# Altium schematic sheet projet_pcb_bluepill_f103.SchDoc
size A2
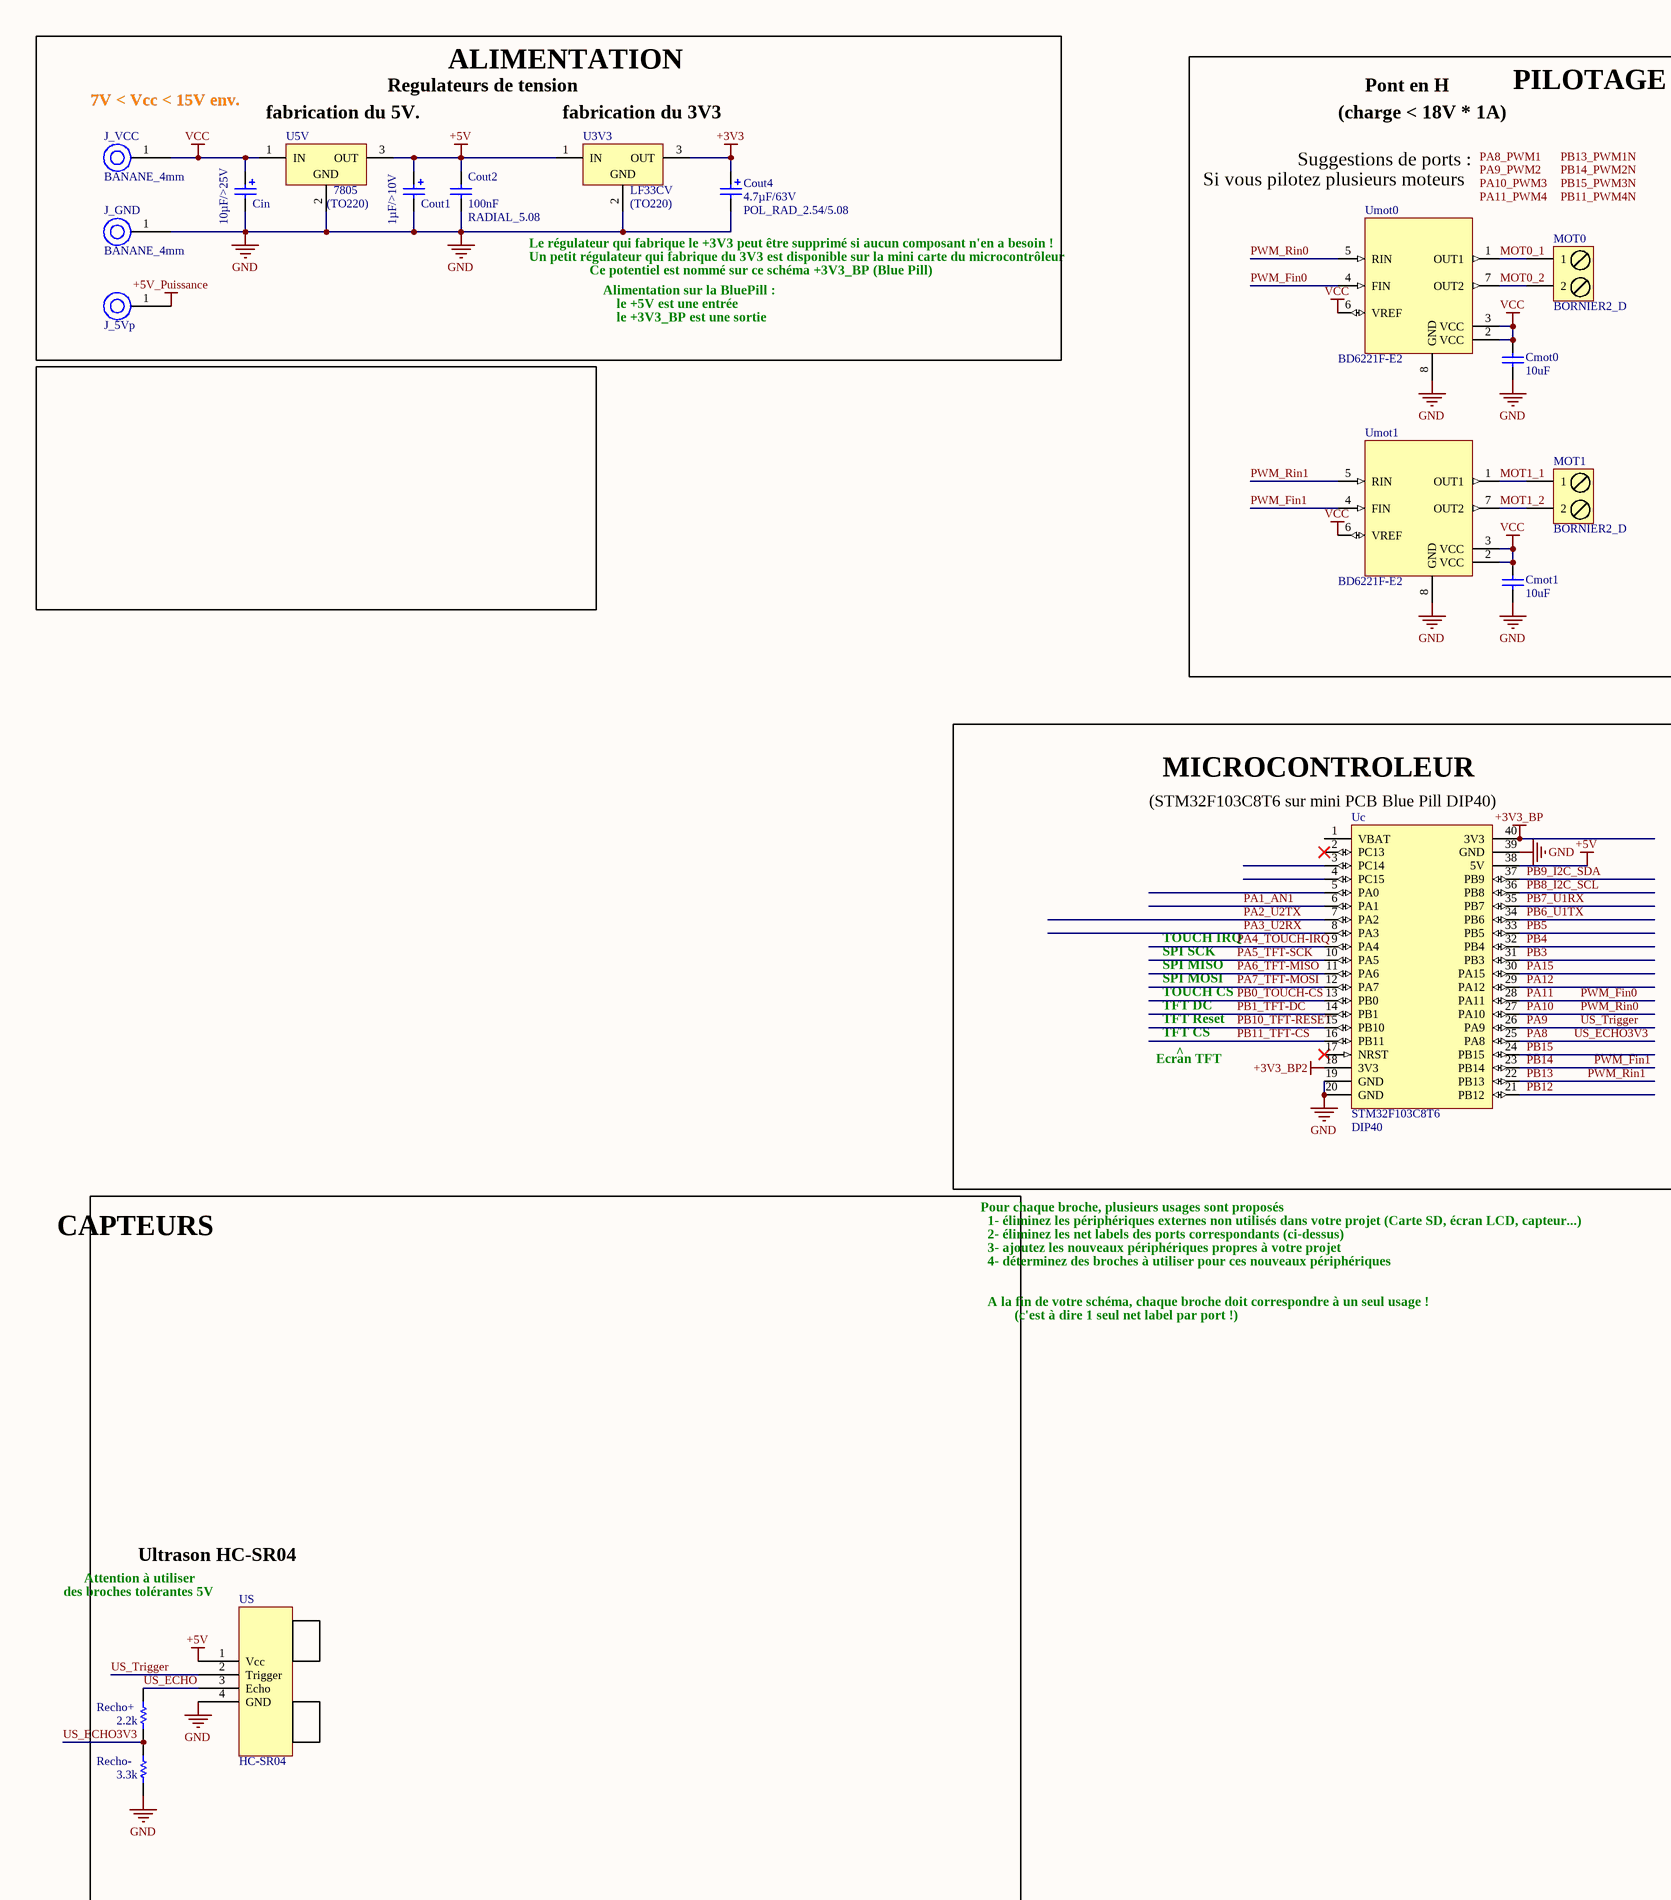
[diagram p0: projet_pcb_bluepill_f103.SchDoc, left]
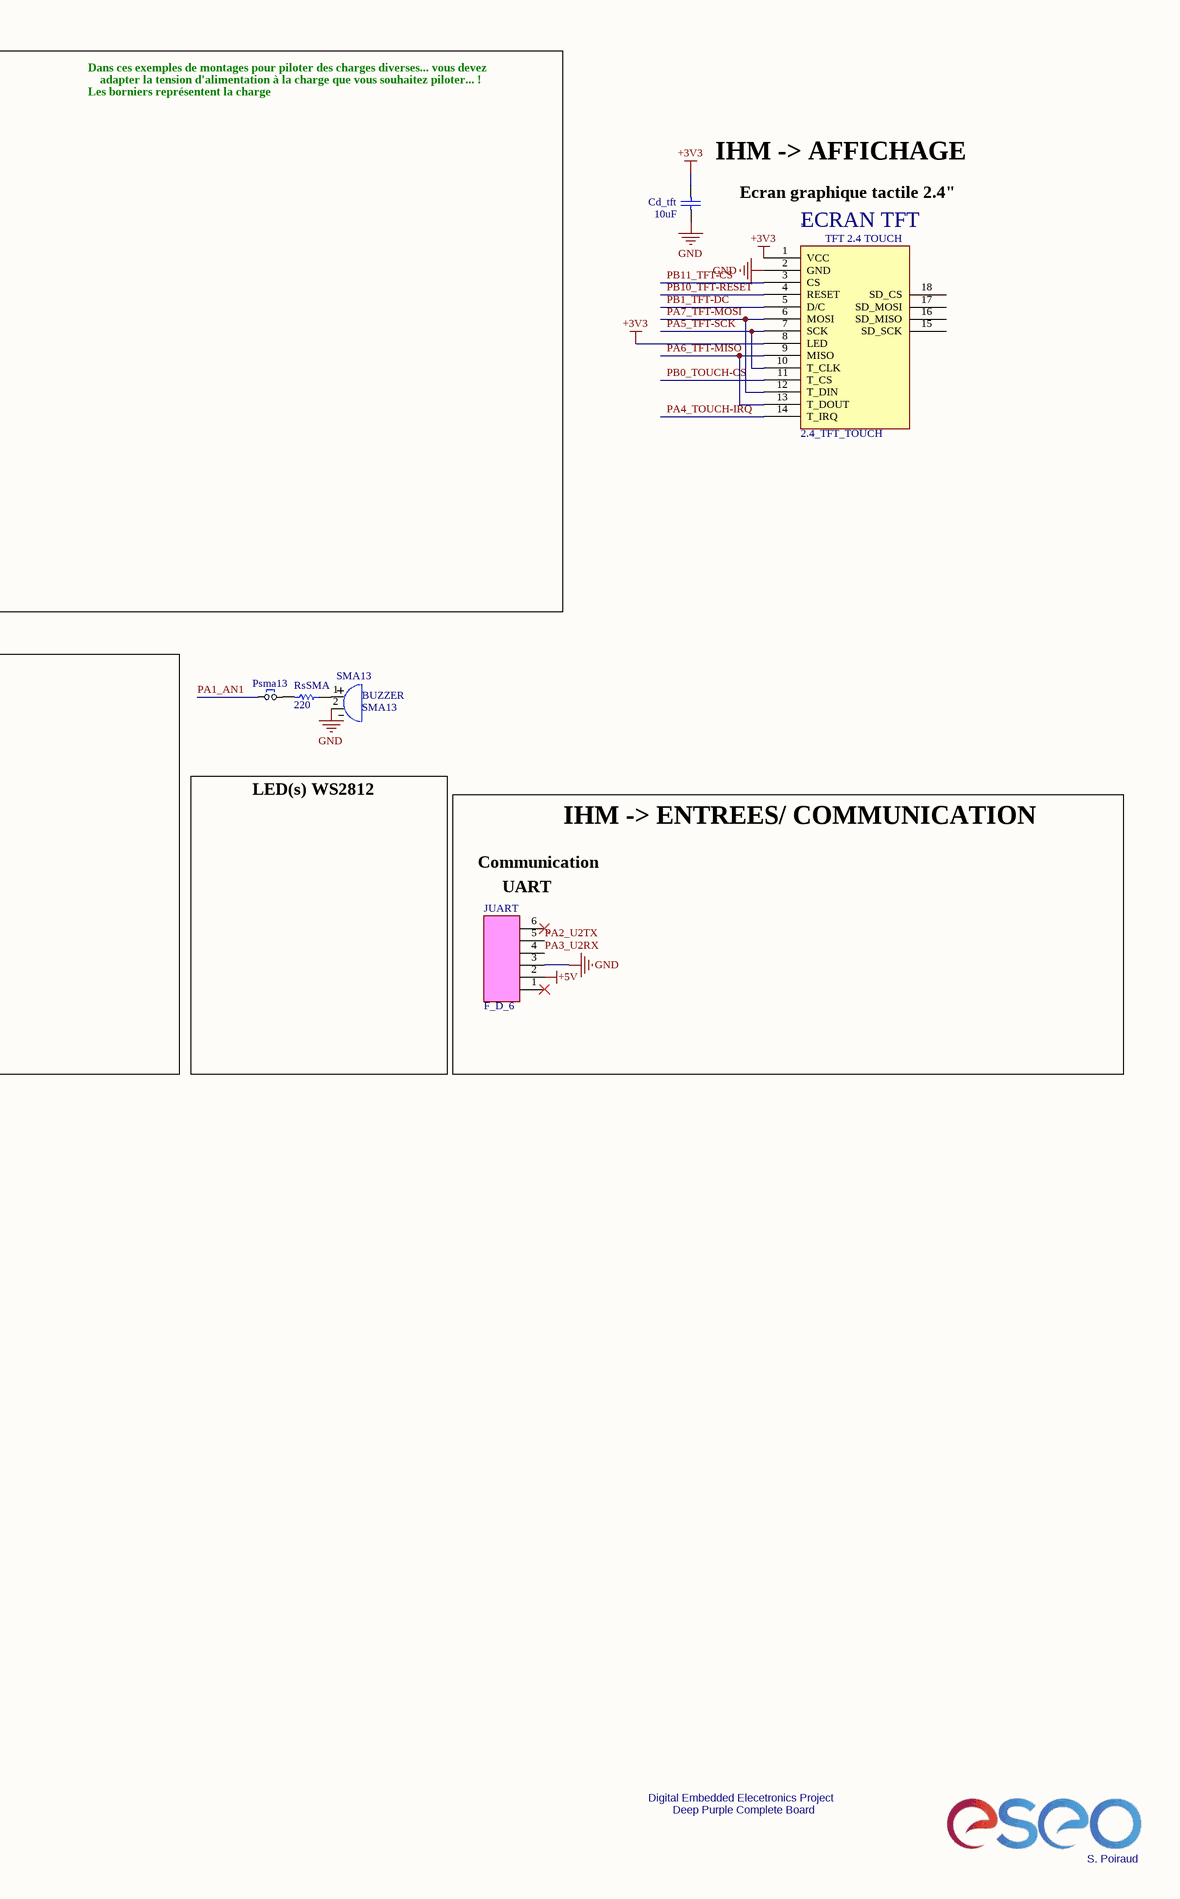
[diagram p1: projet_pcb_bluepill_f103.SchDoc, right]

## Parts
*  2.4_TFT_TOUCH  [2.4_TFT_TOUCH]
Cd_tft  10uF  [CONDENSATEUR_POLARISE_ELECTROLYTIQUE_RADIAL_2.54/5.08]
Cin  value 10µF/>25V  [CONDENSATEUR_POLARISE_ELECTROLYTIQUE_RADIAL_2.0/5.08]  (hidden comment: CONDENSATEUR_POL_ELECTROLY_RAD_2.0/5.08)
Cmot0  10uF  [CONDENSATEUR_POLARISE_ELECTROLYTIQUE_RADIAL_2.0/5.08]
Cmot1  10uF  [CONDENSATEUR_POLARISE_ELECTROLYTIQUE_RADIAL_2.0/5.08]
Cout1  value 1µF/>10V  [CONDENSATEUR_POLARISE_ELECTROLYTIQUE_RADIAL_2.0/5.08]  (hidden comment: CONDENSATEUR_POL_ELECTROLY_RAD_2.0/5.08)
Cout2  value 100nF  Type: RADIAL_5.08  [CONDENSATEUR_CERAMIQUE_RADIAL_5.08]  (hidden comment: CONDENSATEUR_CER_RAD_5.08)
Cout4  value 4.7µF/63V  Type: POL_RAD_2.54/5.08  [CONDENSATEUR_POLARISE_ELECTROLYTIQUE_RADIAL_2.54/5.08]  (hidden comment: CONDENSATEUR_POL_ELECTROLY_RAD_2.54/5.08)
J_5Vp  DOUILLE BANANE 4mm  [DOUILLE_BANANE_4mm]  (value not drawn)
J_GND  Type: BANANE_4mm  [DOUILLE_BANANE_4mm]  (hidden comment: DOUILLE BANANE 4mm)
J_VCC  Type: BANANE_4mm  [DOUILLE_BANANE_4mm]  (hidden comment: DOUILLE BANANE 4mm)
JUART  Type: F_D_6  [BARRETTE_6_F_D]  (hidden comment: BARRETTE_6 CONTACTS_1 RANGEE_FEMELLE_DROITE)
MOT0  Type: BORNIER2_D  [BORNIER2_A_VIS]  (hidden comment: BORNIER2 DROIT A VIS)
MOT1  Type: BORNIER2_D  [BORNIER2_A_VIS]  (hidden comment: BORNIER2 DROIT A VIS)
Psma13  Jumper SIP 2.54  [HDR1X2]  (value not drawn)
Recho+  2.2k  [R1206_N]
Recho-  3.3k  [R1206_N]
RsSMA  220  [R1206_N]
SMA13  value SMA13  Type: BUZZER  [BUZZER_SMA13]  (hidden comment: BUZZER_SMA13)
U3V3  Type: LF33CV  Package: (TO220)  [REGULATEUR_TO220_78XX]  (hidden comment: REGULATEUR_TO220_78XX)
U5V  Type: 7805  Package: (TO220)  [REGULATEUR_TO220_78XX]  (hidden comment: REGULATEUR_TO220_78XX)
Uc  Type: STM32F103C8T6  Package: DIP40  [STM32F103C8T6_DIP40]  (hidden comment: STM32F103C8T6/PCB_DIP40)
Umot0  BD6221F-E2  [SOIC8_PAS=1.27_LARG=4_LONG=5]
Umot1  BD6221F-E2  [SOIC8_PAS=1.27_LARG=4_LONG=5]
US  HC-SR04  [HC-SR04]

## Blocks framed on the sheet
ALIMENTATION: Cin Cout1 Cout2 Cout4 J_5Vp J_GND J_VCC U3V3 U5V
MICROCONTROLEUR: Uc
IHM -> ENTREES/ COMMUNICATION: JUART
Ultrason HC-SR04: Recho+ Recho- US

## Nets
+3V3: *.1(VCC) *.8(LED) Cd_tft.1 Cout4.1 U3V3.3(OUT)
+3V3_BP: Uc.40(3V3)
+3V3_BP2: Uc.18(3V3)
+5V: Cout1.1 Cout2.2 JUART.2 U3V3.1(IN) U5V.3(OUT) Uc.38(5V) US.1(Vcc)
+5V_Puissance: J_5Vp.1
GND: *.2(GND) Cd_tft.2 Cin.2 Cmot0.1 Cmot1.1 Cout1.2 Cout2.1 Cout4.2 J_GND.1 JUART.3 Recho-.1 SMA13.2 U3V3.2(GND) U5V.2(GND) Uc.19(GND) Uc.20(GND) Uc.39(GND) Umot0.8(GND) Umot1.8(GND) US.4(GND)
VCC: Cin.1 Cmot0.2 Cmot1.2 J_VCC.1 U5V.1(IN) Umot0.2(VCC) Umot0.3(VCC) Umot0.6(VREF) Umot1.2(VCC) Umot1.3(VCC) Umot1.6(VREF)
MOT0_1: MOT0.1 Umot0.1(OUT1)
MOT0_2: MOT0.2 Umot0.7(OUT2)
MOT1_1: MOT1.1 Umot1.1(OUT1)
MOT1_2: MOT1.2 Umot1.7(OUT2)
PA1_AN1: Psma13.1 Uc.6(PA1)
PA2_U2TX: JUART.5 Uc.7(PA2)
PA3_U2RX: JUART.4 Uc.8(PA3)
PA4_TOUCH-IRQ: *.14(T_IRQ) Uc.9(PA4)
PA5_TFT-SCK: *.7(SCK) *.10(T_CLK) Uc.10(PA5)
PA6_TFT-MISO: *.9(MISO) *.13(T_DOUT) Uc.11(PA6)
PA7_TFT-MOSI: *.6(MOSI) *.12(T_DIN) Uc.12(PA7)
PA8: Recho+.1 Recho-.2 Uc.25(PA8)  [also labelled US_ECHO3V3]
PA9: Uc.26(PA9) US.2(Trigger)  [also labelled US_Trigger]
PA10: Uc.27(PA10) Umot0.5(RIN)  [also labelled PWM_Rin0]
PA11: Uc.28(PA11) Umot0.4(FIN)  [also labelled PWM_Fin0]
PA12: Uc.29(PA12)
PA15: Uc.30(PA15)
PB0_TOUCH-CS: *.11(T_CS) Uc.13(PB0)
PB1_TFT-DC: *.5(D/C) Uc.14(PB1)
PB3: Uc.31(PB3)
PB4: Uc.32(PB4)
PB5: Uc.33(PB5)
PB6_U1TX: Uc.34(PB6)
PB7_U1RX: Uc.35(PB7)
PB8_I2C_SCL: Uc.36(PB8)
PB9_I2C_SDA: Uc.37(PB9)
PB10_TFT-RESET: *.4(RESET) Uc.15(PB10)
PB11_TFT-CS: *.3(CS) Uc.16(PB11)
PB12: Uc.21(PB12)
PB13: Uc.22(PB13) Umot1.5(RIN)  [also labelled PWM_Rin1]
PB14: Uc.23(PB14) Umot1.4(FIN)  [also labelled PWM_Fin1]
PB15: Uc.24(PB15)
US_ECHO: Recho+.2 US.3(Echo)
NetPsma13_2: Psma13.2 RsSMA.2
NetRsSMA_1: RsSMA.1 SMA13.1

Not connected (* = marked no-connect by the designer): * 15(SD_SCK) 16(SD_MISO) 17(SD_MOSI) 18(SD_CS); JUART 1* 6*; Uc 1(VBAT) 2(PC13)* 3(PC14) 4(PC15) 5(PA0) 17(NRST)*

## Notes on the sheet
- 7V < Vcc < 15V env.
- Regulateurs de tension
- Pont en H
- PILOTAGE
- Dans ces exemples de montages pour piloter des charges diverses... vous devez
- Les borniers représentent la charge
- adapter la tension d'alimentation à la charge que vous souhaitez piloter... !
- (near U5V) fabrication du 5V.
- (near U3V3) fabrication du 3V3
- Suggestions de ports :
- (charge < 18V * 1A)
- Le régulateur qui fabrique le +3V3 peut être supprimé si aucun composant n'en a besoin !
- Si vous pilotez plusieurs moteurs
- (near Cd_tft) IHM -> AFFICHAGE
- Ecran graphique tactile 2.4"
- Un petit régulateur qui fabrique du 3V3 est disponible sur la mini carte du microcontrôleur
- Ce potentiel est nommé sur ce schéma +3V3_BP (Blue Pill)
- Alimentation sur la BluePill :
- le +5V est une entrée
- (near *) ECRAN TFT
- le +3V3_BP est une sortie
- (near Uc) (STM32F103C8T6 sur mini PCB Blue Pill DIP40)
- LED(s) WS2812
- SPI SCK
- SPI MISO
- SPI MOSI
- TOUCH IRQ
- Communication
- TOUCH CS
- TFT DC
- TFT Reset
- TFT CS
- ^
- (near JUART) UART
- Ecran TFT
- CAPTEURS
- Pour chaque broche, plusieurs usages sont proposés
- 1- éliminez les périphériques externes non utilisés dans votre projet (Carte SD, écran LCD, capteur...)
- 2- éliminez les net labels des ports correspondants (ci-dessus)
- 3- ajoutez les nouveaux périphériques propres à votre projet
- 4- déterminez des broches à utiliser pour ces nouveaux périphériques
- A la fin de votre schéma, chaque broche doit correspondre à un seul usage !
- (c'est à dire 1 seul net label par port !)
- des broches tolérantes 5V
- Attention à utiliser
- Digital Embedded Elecetronics Project
- Deep Purple Complete Board
- S. Poiraud
- Labels drawn without touching a wire or pin: PA8_PWM1, PA9_PWM2, PA10_PWM3, PA11_PWM4, PB11_PWM4N, PB13_PWM1N, PB14_PWM2N, PB15_PWM3N
- Title
- Size:
- Date:
- File:
- A2
- Number:
- Time:
- Revision:
- Sheet
- of
- (in symbol 2.4_TFT_TOUCH) TFT 2.4 TOUCH

## Library data of the parts
Cd_tft Cmot0 Cmot1 = Condensateur: Capacitor; Published: 8-Jun-2000; LatestRevisionDate: 17-Jul-2002; LatestRevisionNote: Re-released for DXP Platform.; PackageReference: RAD-0.3; Publisher: Altium Limited
Cin Cout1 = CONDENSATEUR_POL_ELECTROLY_RAD_2.0/5.08: CONDENSATEUR POLARISE ELECTROLYTIQUE RADIAL 2.0/5.08; Type: POL_RAD_2.0/5.08
Cout2 = CONDENSATEUR_CER_RAD_5.08: CONDENSATEUR TRAVERSANT CERAMIQUE RADIAL 5.08mm
Cout4 = CONDENSATEUR_POL_ELECTROLY_RAD_2.54/5.08: CONDENSATEUR POLARISE ELECTROLYTIQUE RADIAL 2.54/5.08
J_5Vp J_GND J_VCC = DOUILLE_BANANE_4mm: DOUILLE BANANE 4 mm
  J_5Vp: Type: BANANE_4mm
JUART = BARRETTE_6 CONTACTS_1 RANGEE_FEMELLE_DROITE: BARRETTE 6 CONTACTS 1 RANGEE FEMELLE DROITE
MOT0 MOT1 = BORNIER2_DROIT_A VIS: BORNIER 2 PLOTS DROIT A VIS 5.08mm
Psma13 = Jumper SIP2.54
Recho+ Recho- RsSMA = Resistor: Published: 8-Jun-2000; LatestRevisionDate: 17-Jul-2002; LatestRevisionNote: Re-released for DXP Platform.; PackageReference: AXIAL-0.5; Publisher: Altium Limited
SMA13 = BUZZER_SMA13: BUZZER SMA13
U3V3 U5V = REGULATEUR_TO220_78XX: REGULATEUR DE TENSION POSITIVE 78XX BOITIER TO220
Uc = STM32F103C8T6/PCB_DIP40: MICROCONTROLEUR 32 BITS - 72MHz - 34 I/O - 64 KO : FLASH - 20KO RAM - 10 CANAUX A/D 12 BITS - DIP40 - UART, SPI, I2C, USB, CAN
Umot0 Umot1 = BD6220F: H Bridge - 2A